# EAGLE schematic HDMI_RGB_LVDS (EAGLE 6.3)

## Sheet 1 of 6
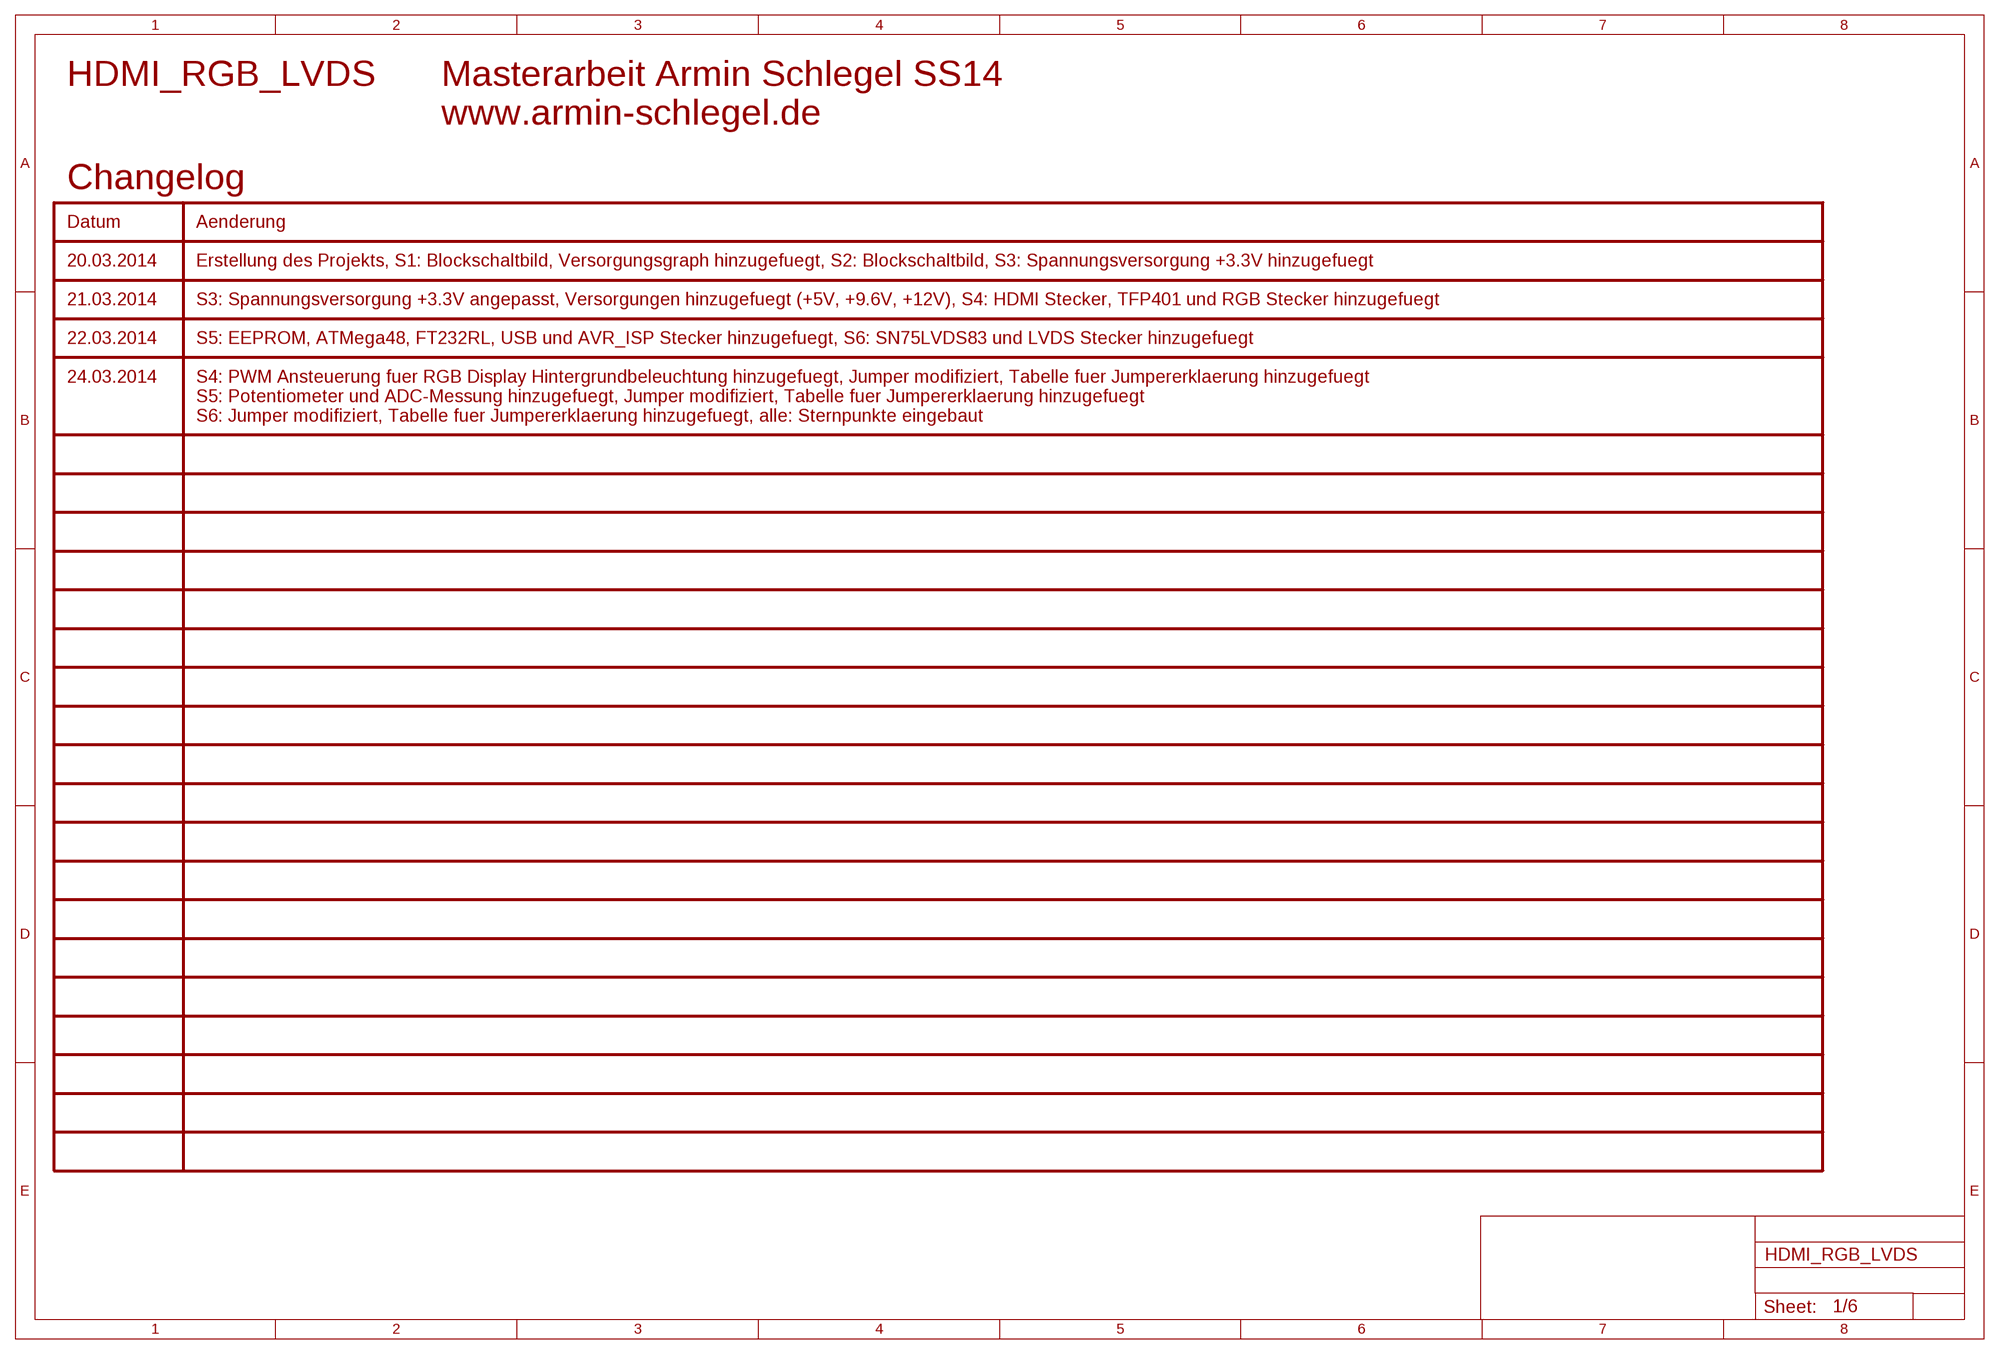
[diagram p0: schematic, sheet 1]

### Parts
U$1  FRAME_A3_LANDSCAPE  [FRAME]

### Notes on the sheet
- HDMI_RGB_LVDS | Masterarbeit Armin Schlegel SS14
- www.armin-schlegel.de
- Changelog
- Datum | Aenderung
- 20.03.2014 | Erstellung des Projekts, S1: Blockschaltbild, Versorgungsgraph hinzugefuegt, S2: Blockschaltbild, S3: Spannungsversorgung +3.3V hinzugefuegt
- 21.03.2014 | S3: Spannungsversorgung +3.3V angepasst, Versorgungen hinzugefuegt (+5V, +9.6V, +12V), S4: HDMI Stecker, TFP401 und RGB Stecker hinzugefuegt
- 22.03.2014 | S5: EEPROM, ATMega48, FT232RL, USB und AVR_ISP Stecker hinzugefuegt, S6: SN75LVDS83 und LVDS Stecker hinzugefuegt
- 24.03.2014
- S4: PWM Ansteuerung fuer RGB Display Hintergrundbeleuchtung hinzugefuegt, Jumper modifiziert, Tabelle fuer Jumpererklaerung hinzugefuegt
  S5: Potentiometer und ADC-Messung hinzugefuegt, Jumper modifiziert, Tabelle fuer Jumpererklaerung hinzugefuegt
  S6: Jumper modifiziert, Tabelle fuer Jumpererklaerung hinzugefuegt, alle: Sternpunkte eingebaut

## Sheet 2 of 6
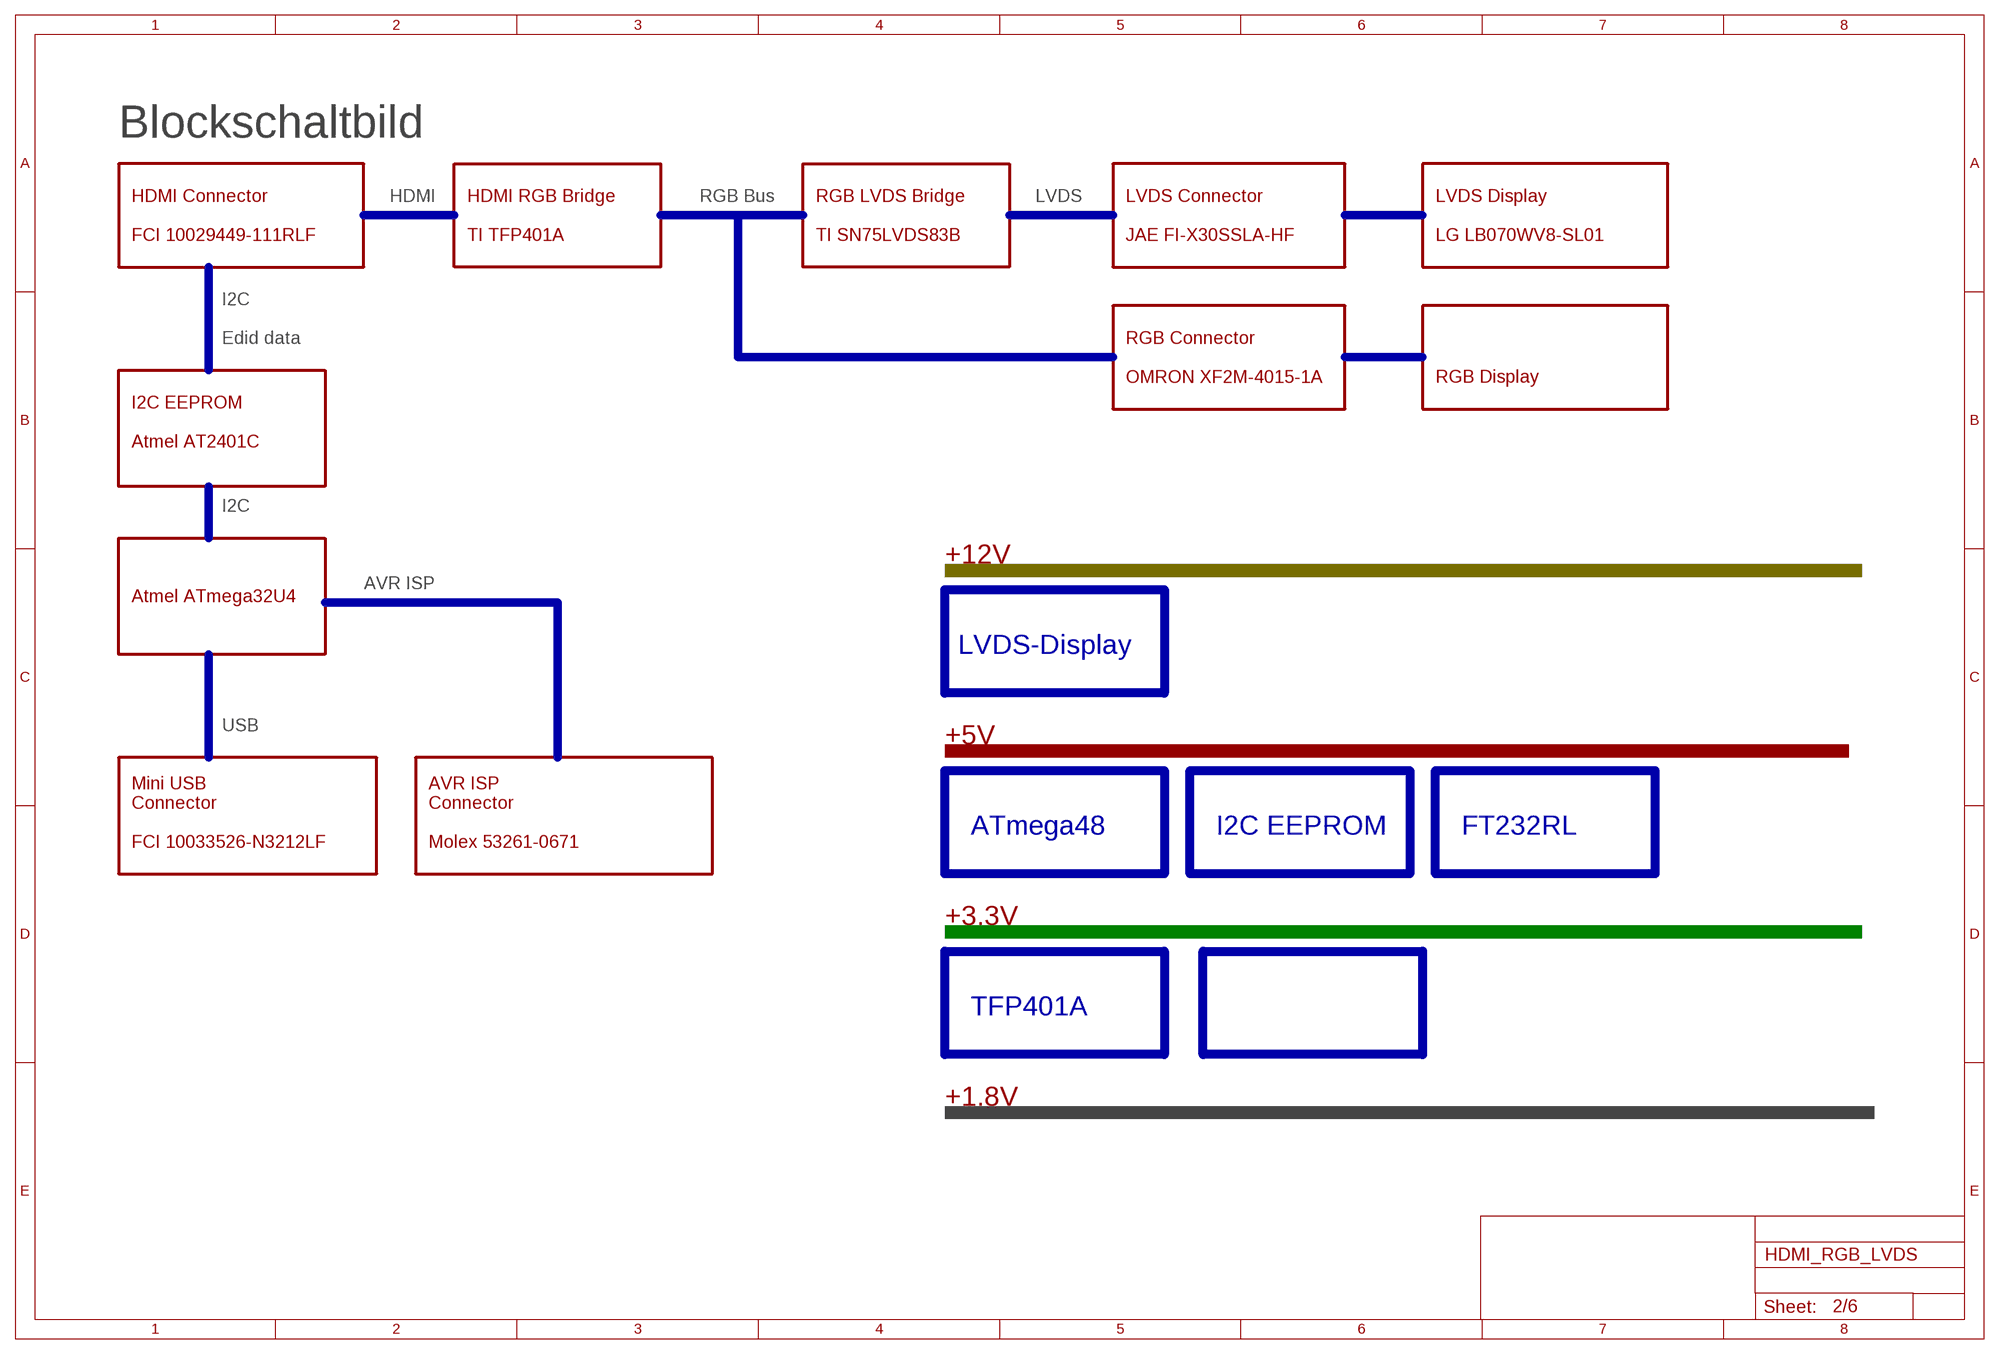
[diagram p1: schematic, sheet 2]

### Parts
U$15  FRAME_A3_LANDSCAPE  [FRAME]

### Buses
B$1
B$2
B$3
B$4
B$5
B$6
B$7
B$8
B$9
B$10
B$11
B$12

### Notes on the sheet
- Blockschaltbild
- HDMI | RGB Bus | LVDS
- HDMI Connector
  
  FCI 10029449-111RLF
- HDMI RGB Bridge
  
  TI TFP401A
- RGB LVDS Bridge
  
  TI SN75LVDS83B
- LVDS Connector
  
  JAE FI-X30SSLA-HF
- LVDS Display
  
  LG LB070WV8-SL01
- I2C
- Edid data
- RGB Connector
  
  OMRON XF2M-4015-1A
- RGB Display
- I2C EEPROM
  
  Atmel AT2401C
- I2C
- +12V
- AVR ISP
- Atmel ATmega32U4
- LVDS-Display
- USB
- +5V
- ATmega48 | I2C EEPROM | FT232RL
- Mini USB
  Connector
  
  FCI 10033526-N3212LF
- AVR ISP
  Connector
  
  Molex 53261-0671
- +3.3V
- TFP401A
- +1.8V

## Sheet 3 of 6
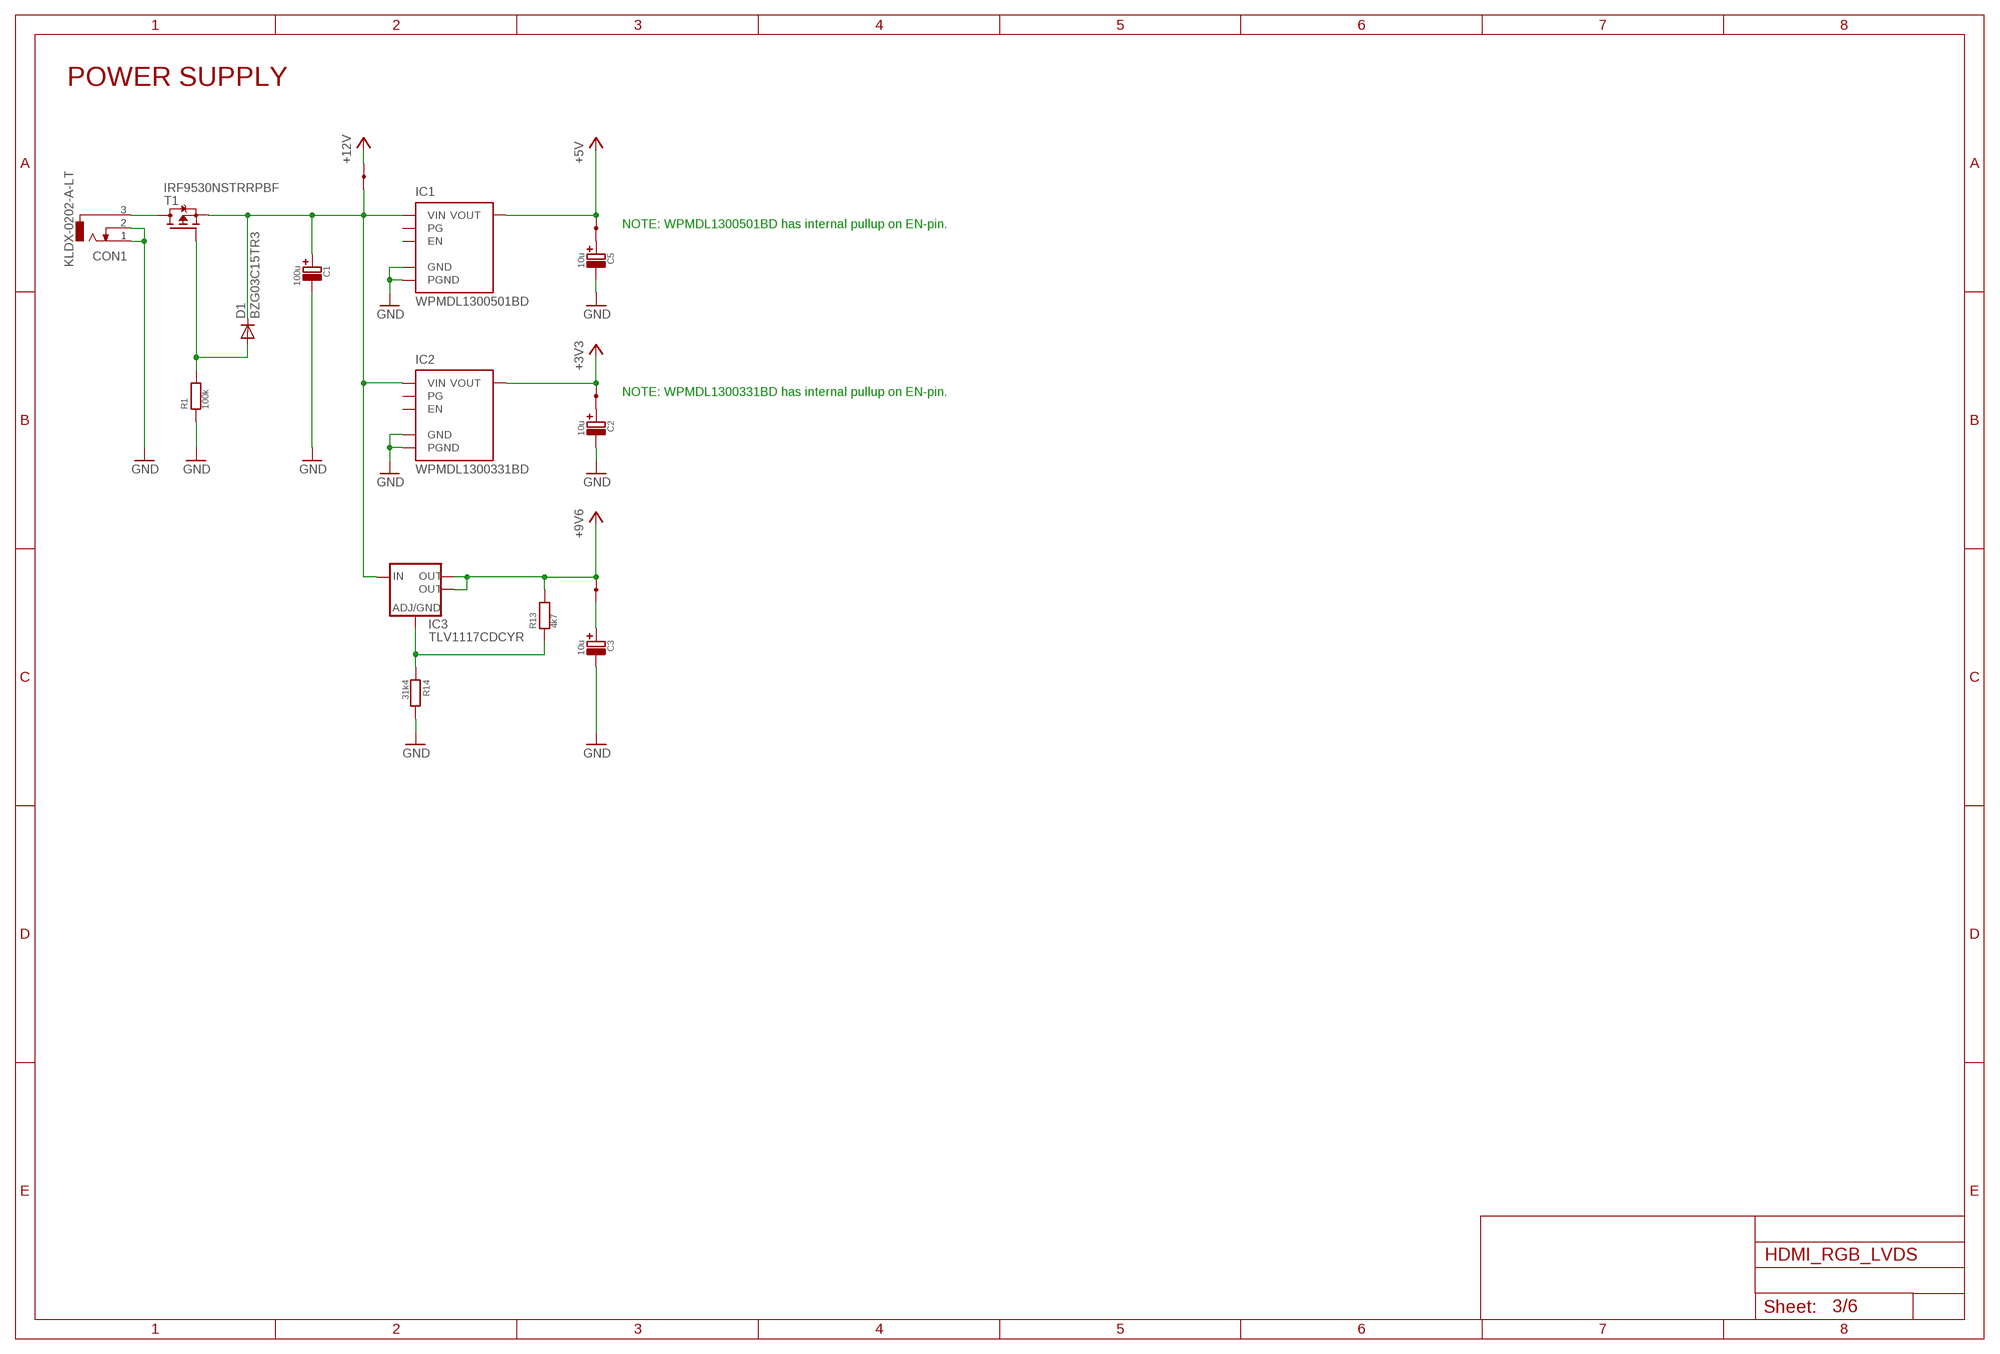
[diagram p2: schematic, sheet 3]

### Parts
C1  100u  C_POL6X6MM  [C_POL_6X6MM]
C2  10u  C_POL4X4MM  [C_POL_4X4MM]
C3  10u  C_POL4X4MM  [C_POL_4X4MM]
C5  10u  C_POL4X4MM  [C_POL_4X4MM]
CON1  KLDX-0202-A-LT  [KLDX-0202-A-LT]
D1  BZG03C15TR3  [DO214A]
IC1  WPMDL1300501BD  [TO263-5]
IC2  WPMDL1300331BD  [TO263-5]
IC3  TLV1117CDCYR  [SOT223]
R1  100k  R0402  [R0402]
R13  4k7  R0402  [R0402]
R14  31k4  R0402  [R0402]
SP1  SP2  [SP2]
T1  IRF9530NSTRRPBF  [D2PAK]
U$2  FRAME_A3_LANDSCAPE  [FRAME]
U$95  SP2  [SP2]
U$96  SP2  [SP2]
U$97  SP2  [SP2]

### Nets
+3V3: IC2.3(VOUT) U$96.P$2 ; also sheet 4,6
+5V: IC1.3(VOUT) U$95.P$2 ; also sheet 4,5
+9V6: IC3.2(OUT) IC3.4(OUT1) R13.2 U$97.P$2 ; also sheet 4
+12V: SP1.P$2 ; also sheet 6
GND: C1.- C2.- C3.- C5.- CON1.1 CON1.2 IC1.2(GND) IC1.6(PGND) IC2.2(GND) IC2.6(PGND) R1.1 R14.2 ; also sheet 4,5,6
N$2: CON1.3 T1.2(D)
N$4: D1.A R1.2 T1.1(G)
N$35: IC3.1(GND) R13.1 R14.1
N$51: C2.+ U$96.P$1
N$55: C3.+ U$97.P$1
N$56: C5.+ U$95.P$1
N$59: C1.+ D1.C IC1.1(VIN) IC2.1(VIN) IC3.3(IN) SP1.P$1 T1.3(S)
Unconnected: IC1.4(PG) IC1.5(EN) IC2.4(PG) IC2.5(EN)

### Notes on the sheet
- POWER SUPPLY
- NOTE: WPMDL1300501BD has internal pullup on EN-pin.
- NOTE: WPMDL1300331BD has internal pullup on EN-pin.

## Sheet 4 of 6
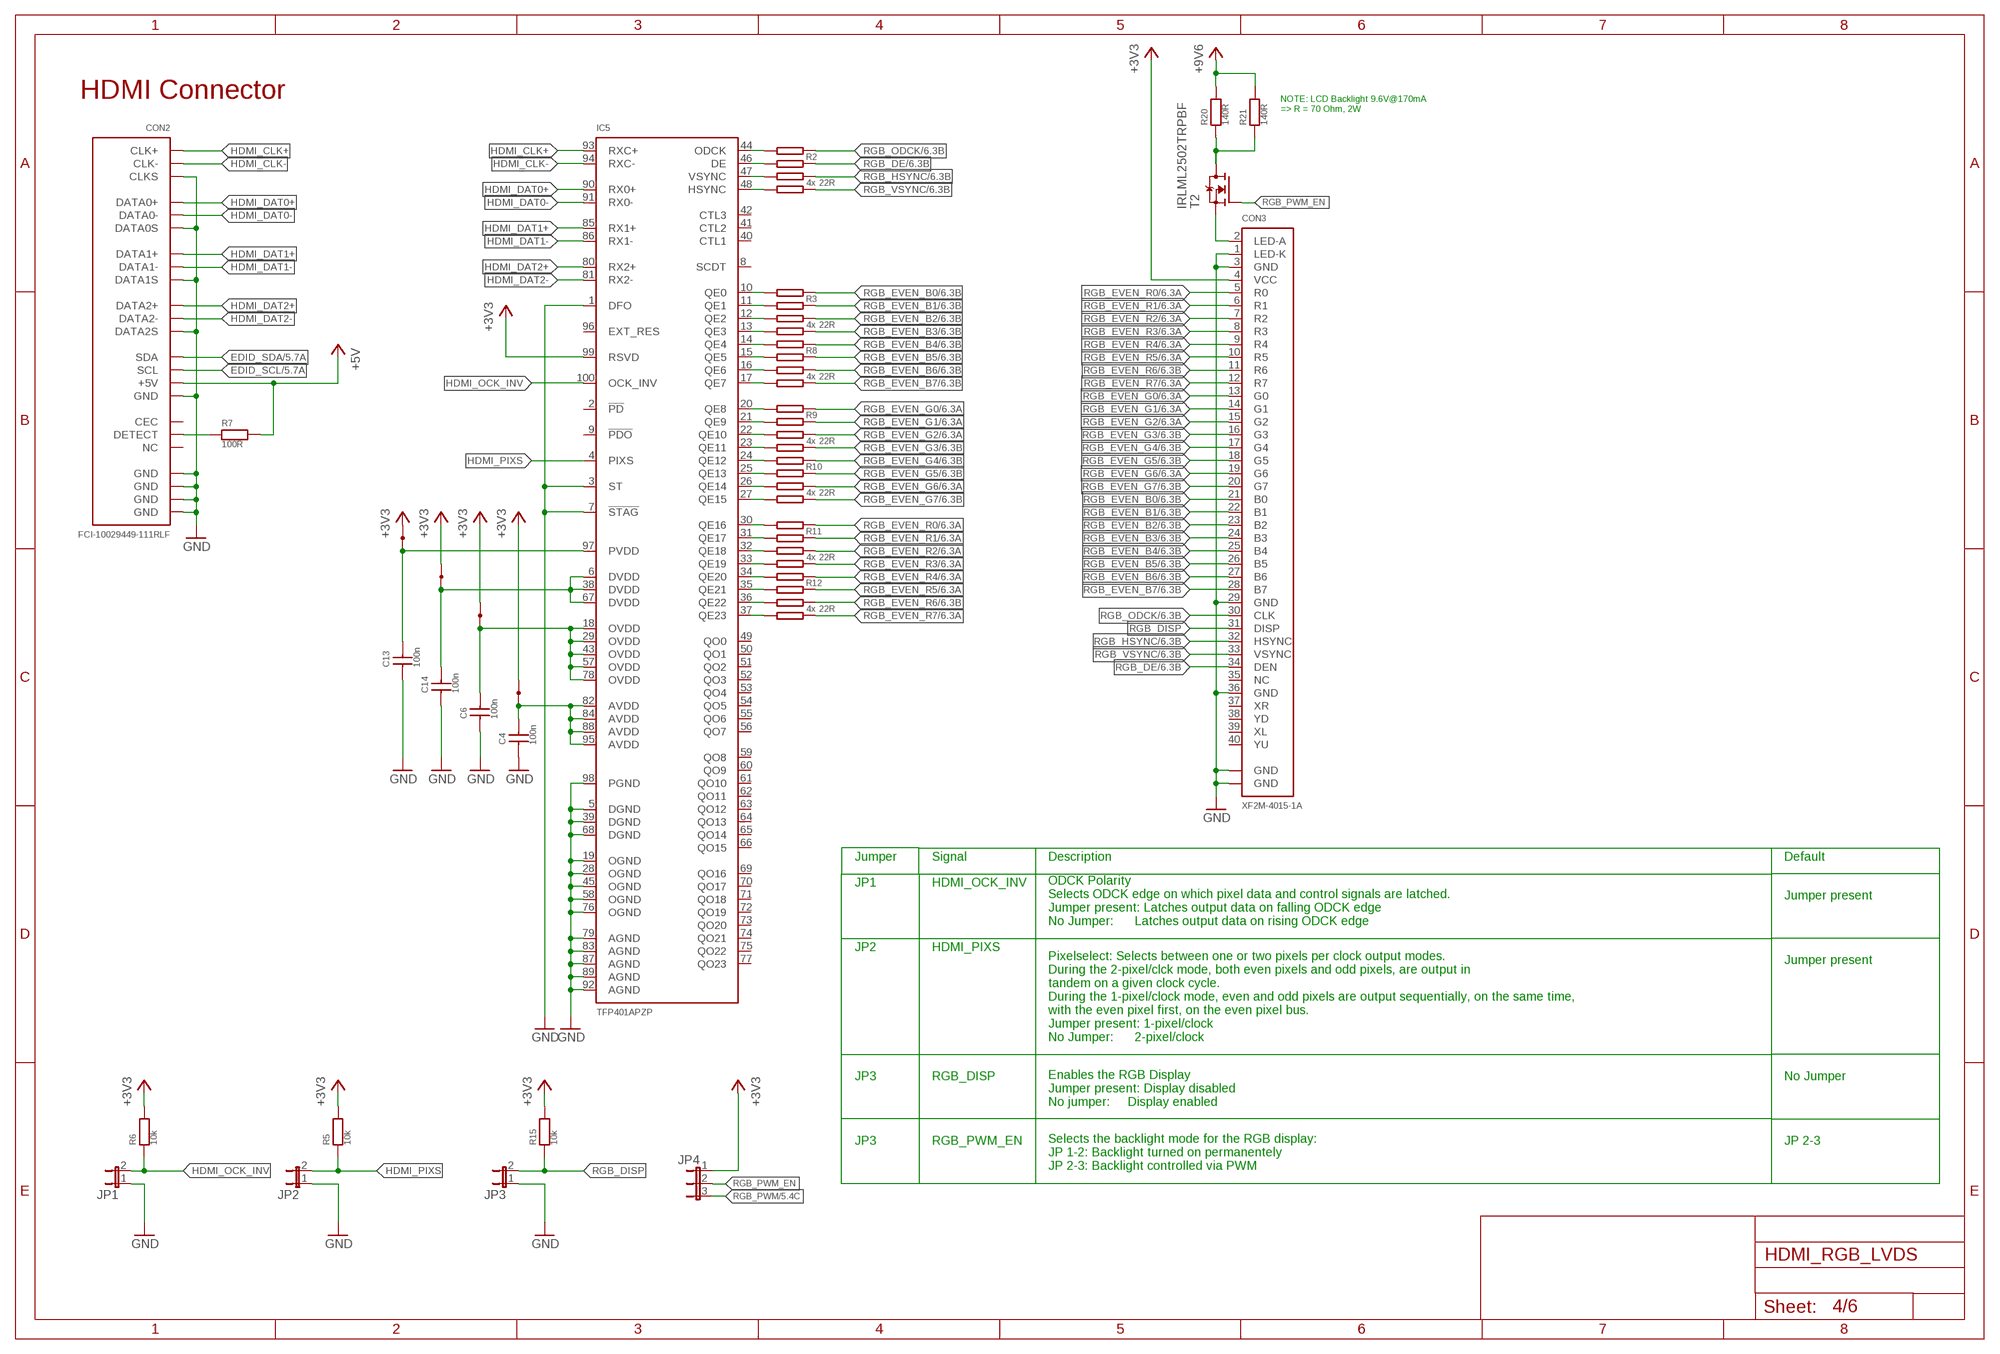
[diagram p3: schematic, sheet 4]

### Parts
C4  100n  C_SMD0402  [C0402]
C6  100n  C_SMD0402  [C0402]
C13  100n  C_SMD0402  [C0402]
C14  100n  C_SMD0402  [C0402]
CON2  FCI-10029449-111RLF  [FCI-10029449-111RLF]
CON3  XF2M-4015-1A  [XF2M-4015-1A]
IC5  TFP401APZP  [HTQFP-100]
JP1  JUMPER2  [JUMPER2_THROUGHHOLE]
JP2  JUMPER2  [JUMPER2_THROUGHHOLE]
JP3  JUMPER2  [JUMPER2_THROUGHHOLE]
JP4  JUMPER3  [JUMPER3_THROUGHHOLE]
R2  22R  CTR-742C083220JP-4X22R-4X0603  [R-ARRAY-4X0603]
R3  22R  CTR-742C083220JP-4X22R-4X0603  [R-ARRAY-4X0603]
R5  10k  R0402  [R0402]
R6  10k  R0402  [R0402]
R7  100R  R0402  [R0402]
R8  22R  CTR-742C083220JP-4X22R-4X0603  [R-ARRAY-4X0603]
R9  22R  CTR-742C083220JP-4X22R-4X0603  [R-ARRAY-4X0603]
R10  22R  CTR-742C083220JP-4X22R-4X0603  [R-ARRAY-4X0603]
R11  22R  CTR-742C083220JP-4X22R-4X0603  [R-ARRAY-4X0603]
R12  22R  CTR-742C083220JP-4X22R-4X0603  [R-ARRAY-4X0603]
R15  10k  R0402  [R0402]
R20  140R  R2512  [R2512]
R21  140R  R2512  [R2512]
SP2  SP2  [SP2]
SP3  SP2  [SP2]
SP4  SP2  [SP2]
SP5  SP2  [SP2]
T2  IRLML2502TRPBF  [SOT23]
U$3  FRAME_A3_LANDSCAPE  [FRAME]

### Nets
+3V3: CON3.4(VCC) IC5.99(RSVD) JP4.1 R5.2 R6.2 R15.2 SP2.P$2 SP3.P$2 SP4.P$2 SP5.P$2 ; also sheet 3,6
+5V: CON2.18(+5V) R7.2 ; also sheet 3,5
+9V6: R20.2 R21.2 ; also sheet 3
EDID_SCL: CON2.15(SCL) ; also sheet 5
EDID_SDA: CON2.16(SDA) ; also sheet 5
GND: C4.1 C6.1 C13.1 C14.1 CON2.2(DATA2S) CON2.5(DATA1S) CON2.8(DATA0S) CON2.11(CLKS) CON2.17(GND) CON2.GND@1(GND) CON2.GND@2(GND) CON2.GND@3(GND) CON2.GND@4(GND) CON3.1(LED-K) CON3.3(GND) CON3.29(GND) CON3.36(GND) CON3.GND@1(GND) CON3.GND@2(GND) IC5.1(DFO) IC5.3(ST) IC5.5(DGND) IC5.7(!STAG) IC5.19(OGND) IC5.28(OGND) IC5.39(DGND) IC5.45(OGND) IC5.58(OGND) IC5.68(DGND) IC5.76(OGND) IC5.79(AGND) IC5.83(AGND) IC5.87(AGND) IC5.89(AGND) IC5.92(AGND) IC5.98(PGND) JP1.1 JP2.1 JP3.1 ; also sheet 3,5,6
HDMI_CLK+: CON2.10(CLK+) IC5.93(RXC+)
HDMI_CLK-: CON2.12(CLK-) IC5.94(RXC-)
HDMI_DAT0+: CON2.7(DATA0+) IC5.90(RX0+)
HDMI_DAT0-: CON2.9(DATA0-) IC5.91(RX0-)
HDMI_DAT1+: CON2.4(DATA1+) IC5.85(RX1+)
HDMI_DAT1-: CON2.6(DATA1-) IC5.86(RX1-)
HDMI_DAT2+: CON2.1(DATA2+) IC5.80(RX2+)
HDMI_DAT2-: CON2.3(DATA2-) IC5.81(RX2-)
HDMI_OCK_INV: IC5.100(OCK_INV) JP1.2 R6.1
HDMI_PIXS: IC5.4(PIXS) JP2.2 R5.1
N$1: IC5.48(HSYNC) R2.1M
N$6: IC5.47(VSYNC) R2.2M
N$7: IC5.46(DE) R2.3M
N$8: IC5.44(ODCK) R2.4M
N$9: IC5.13(QE3) R3.1M
N$11: IC5.12(QE2) R3.2M
N$12: IC5.11(QE1) R3.3M
N$13: IC5.10(QE0) R3.4M
N$14: IC5.17(QE7) R8.1M
N$15: IC5.16(QE6) R8.2M
N$16: IC5.15(QE5) R8.3M
N$17: IC5.14(QE4) R8.4M
N$18: CON2.19(DETECT) R7.1
N$19: IC5.23(QE11) R9.1M
N$20: IC5.22(QE10) R9.2M
N$21: IC5.21(QE9) R9.3M
N$22: IC5.20(QE8) R9.4M
N$23: IC5.27(QE15) R10.1M
N$24: IC5.26(QE14) R10.2M
N$25: IC5.25(QE13) R10.3M
N$26: IC5.24(QE12) R10.4M
N$27: IC5.33(QE19) R11.1M
N$28: IC5.32(QE18) R11.2M
N$29: IC5.31(QE17) R11.3M
N$30: IC5.30(QE16) R11.4M
N$31: IC5.37(QE23) R12.1M
N$32: IC5.36(QE22) R12.2M
N$33: IC5.35(QE21) R12.3M
N$34: IC5.34(QE20) R12.4M
N$37: CON3.2(LED-A) T2.2(S)
N$50: C6.2 IC5.18(OVDD) IC5.29(OVDD) IC5.43(OVDD) IC5.57(OVDD) IC5.78(OVDD) SP4.P$1
N$52: C4.2 IC5.82(AVDD) IC5.84(AVDD) IC5.88(AVDD) IC5.95(AVDD) SP5.P$1
N$53: C13.2 IC5.97(PVDD) SP2.P$1
N$54: C14.2 IC5.6(DVDD) IC5.38(DVDD) IC5.67(DVDD) SP3.P$1
N$57: R20.1 R21.1 T2.3(D)
RGB_DE: CON3.34(DEN) R2.3P ; also sheet 6
RGB_DISP: CON3.31(DISP) JP3.2 R15.1
RGB_EVEN_B0: CON3.21(B0) R3.4P ; also sheet 6
RGB_EVEN_B1: CON3.22(B1) R3.3P ; also sheet 6
RGB_EVEN_B2: CON3.23(B2) R3.2P ; also sheet 6
RGB_EVEN_B3: CON3.24(B3) R3.1P ; also sheet 6
RGB_EVEN_B4: CON3.25(B4) R8.4P ; also sheet 6
RGB_EVEN_B5: CON3.26(B5) R8.3P ; also sheet 6
RGB_EVEN_B6: CON3.27(B6) R8.2P ; also sheet 6
RGB_EVEN_B7: CON3.28(B7) R8.1P ; also sheet 6
RGB_EVEN_G0: CON3.13(G0) R9.4P ; also sheet 6
RGB_EVEN_G1: CON3.14(G1) R9.3P ; also sheet 6
RGB_EVEN_G2: CON3.15(G2) R9.2P ; also sheet 6
RGB_EVEN_G3: CON3.16(G3) R9.1P ; also sheet 6
RGB_EVEN_G4: CON3.17(G4) R10.4P ; also sheet 6
RGB_EVEN_G5: CON3.18(G5) R10.3P ; also sheet 6
RGB_EVEN_G6: CON3.19(G6) R10.2P ; also sheet 6
RGB_EVEN_G7: CON3.20(G7) R10.1P ; also sheet 6
RGB_EVEN_R0: CON3.5(R0) R11.4P ; also sheet 6
RGB_EVEN_R1: CON3.6(R1) R11.3P ; also sheet 6
RGB_EVEN_R2: CON3.7(R2) R11.2P ; also sheet 6
RGB_EVEN_R3: CON3.8(R3) R11.1P ; also sheet 6
RGB_EVEN_R4: CON3.9(R4) R12.4P ; also sheet 6
RGB_EVEN_R5: CON3.10(R5) R12.3P ; also sheet 6
RGB_EVEN_R6: CON3.11(R6) R12.2P ; also sheet 6
RGB_EVEN_R7: CON3.12(R7) R12.1P ; also sheet 6
RGB_HSYNC: CON3.32(HSYNC) R2.2P ; also sheet 6
RGB_ODCK: CON3.30(CLK) R2.4P ; also sheet 6
RGB_PWM: JP4.3 ; also sheet 5
RGB_PWM_EN: JP4.2 T2.1(G)
RGB_VSYNC: CON3.33(VSYNC) R2.1P ; also sheet 6
Unconnected: CON2.13(CEC) CON2.14(NC) CON3.35(NC) CON3.37(XR) CON3.38(YD) CON3.39(XL) CON3.40(YU) IC5.2(!PD) IC5.8(SCDT) IC5.9(!PDO) IC5.40(CTL1) IC5.41(CTL2) IC5.42(CTL3) IC5.49(QO0) IC5.50(QO1) IC5.51(QO2) IC5.52(QO3) IC5.53(QO4) IC5.54(QO5) IC5.55(QO6) IC5.56(QO7) IC5.59(QO8) IC5.60(QO9) IC5.61(QO10) IC5.62(QO11) IC5.63(QO12) IC5.64(QO13) IC5.65(QO14) IC5.66(QO15) IC5.69(QO16) IC5.70(QO17) IC5.71(QO18) IC5.72(QO19) IC5.73(QO20) IC5.74(QO21) IC5.75(QO22) IC5.77(QO23) IC5.96(EXT_RES)

### Notes on the sheet
- HDMI Connector
- NOTE: LCD Backlight 9.6V@170mA
  => R = 70 Ohm, 2W
- Jumper | Signal | Description | Default
- JP1 | HDMI_OCK_INV
- Jumper present
- ODCK Polarity
  Selects ODCK edge on which pixel data and control signals are latched. 
  Jumper present: Latches output data on falling ODCK edge 
  No Jumper:      Latches output data on rising ODCK edge
- JP2 | HDMI_PIXS
- Jumper present
- Pixelselect: Selects between one or two pixels per clock output modes. 
  During the 2-pixel/clck mode, both even pixels and odd pixels, are output in 
  tandem on a given clock cycle.
  During the 1-pixel/clock mode, even and odd pixels are output sequentially, on the same time,
  with the even pixel first, on the even pixel bus.
  Jumper present: 1-pixel/clock
  No Jumper:      2-pixel/clock
- JP3 | RGB_DISP | No Jumper
- Enables the RGB Display
  Jumper present: Display disabled
  No jumper:     Display enabled
- JP3 | RGB_PWM_EN | JP 2-3
- Selects the backlight mode for the RGB display:
  JP 1-2: Backlight turned on permanentely
  JP 2-3: Backlight controlled via PWM

## Sheet 5 of 6
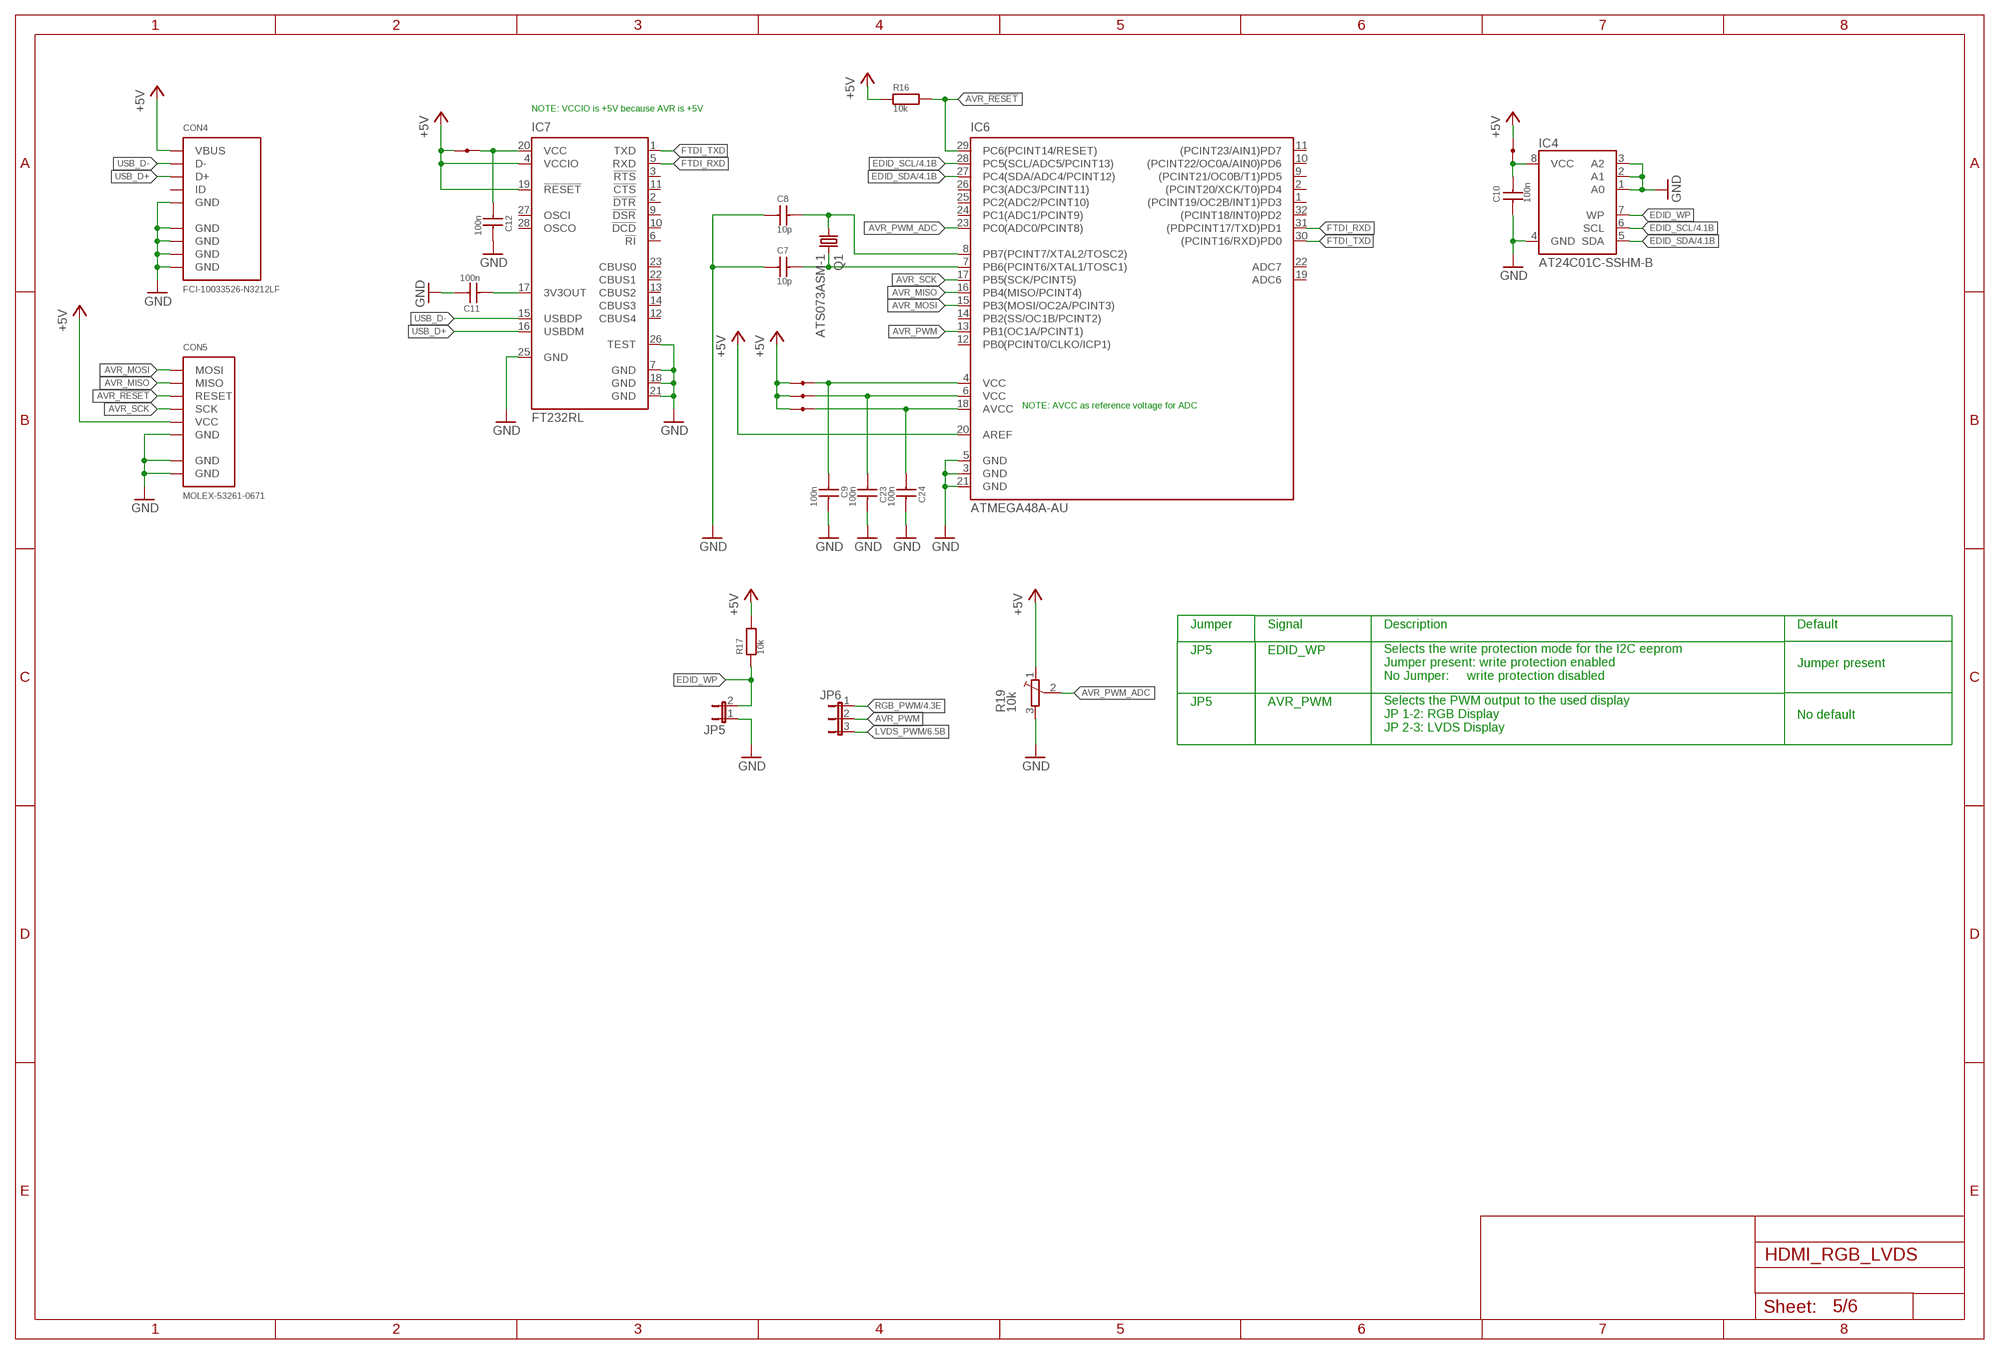
[diagram p4: schematic, sheet 5]

### Parts
C7  10p  C_SMD0402  [C0402]
C8  10p  C_SMD0402  [C0402]
C9  100n  C_SMD0402  [C0402]
C10  100n  C_SMD0402  [C0402]
C11  100n  C_SMD0402  [C0402]
C12  100n  C_SMD0402  [C0402]
C23  100n  C_SMD0402  [C0402]
C24  100n  C_SMD0402  [C0402]
CON4  FCI-10033526-N3212LF  [FCI-10033526-N3212LF]
CON5  MOLEX-53261-0671  [MOLEX-53261-0671]
IC4  AT24C01C-SSHM-B  [SOIC8]
IC6  ATMEGA48A-AU  [TQFP32]
IC7  FT232RL  [SSOP28]
JP5  JUMPER2  [JUMPER2_THROUGHHOLE]
JP6  JUMPER3  [JUMPER3_THROUGHHOLE]
Q1  ATS073ASM-1  [HC49/USSM]
R16  10k  R0402  [R0402]
R17  10k  R0402  [R0402]
R19  10k  35WR5KLFTR  [35WR5KLFTR]
SP9  SP2  [SP2]
SP10  SP2  [SP2]
SP11  SP2  [SP2]
SP12  SP2  [SP2]
SP13  SP2  [SP2]
U$4  FRAME_A3_LANDSCAPE  [FRAME]

### Nets
+5V: CON4.1(VBUS) CON5.5(VCC) IC6.20(AREF) IC7.4(VCCIO) IC7.19(!RESET) R16.1 R17.2 R19.1(E) SP9.P$2 SP10.P$1 SP11.P$1 SP12.P$1 SP13.P$1 ; also sheet 3,4
AVR_!RESET: CON5.3(RESET) IC6.29(PC6(PCINT14/RESET)) R16.2
AVR_MISO: CON5.2(MISO) IC6.16(PB4(MISO/PCINT4))
AVR_MOSI: CON5.1(MOSI) IC6.15(PB3(MOSI/OC2A/PCINT3))
AVR_PWM: IC6.13(PB1(OC1A/PCINT1)) JP6.2
AVR_PWM_ADC: IC6.23(PC0(ADC0/PCINT8)) R19.2(S)
AVR_SCK: CON5.4(SCK) IC6.17(PB5(SCK/PCINT5))
AVR_XTAL1: C7.2 IC6.7(PB6(PCINT6/XTAL1/TOSC1)) Q1.2
AVR_XTAL2: C8.2 IC6.8(PB7(PCINT7/XTAL2/TOSC2)) Q1.1
EDID_SCL: IC4.6(SCL) IC6.28(PC5(SCL/ADC5/PCINT13)) ; also sheet 4
EDID_SDA: IC4.5(SDA) IC6.27(PC4(SDA/ADC4/PCINT12)) ; also sheet 4
EDID_WP: IC4.7(WP) JP5.2 R17.1
FTDI_3V3OUT: C11.1 IC7.17(3V3OUT)
FTDI_RXD: IC6.31((PDPCINT17/TXD)PD1) IC7.5(RXD)
FTDI_TXD: IC6.30((PCINT16/RXD)PD0) IC7.1(TXD)
GND: C7.1 C8.1 C9.2 C10.1 C11.2 C12.2 C23.2 C24.2 CON4.5(GND) CON4.GND@1(GND) CON4.GND@2(GND) CON4.GND@3(GND) CON4.GND@4(GND) CON5.6(GND) CON5.GND@1(GND) CON5.GND@2(GND) IC4.1(A0) IC4.2(A1) IC4.3(A2) IC4.4(GND) IC6.3(GND) IC6.5(GND) IC6.21(GND) IC7.7(GND) IC7.18(GND) IC7.21(GND) IC7.25(GND) IC7.26(TEST) JP5.1 R19.3(A) ; also sheet 3,4,6
LVDS_PWM: JP6.3 ; also sheet 6
N$44: C12.1 IC7.20(VCC) SP9.P$1
N$45: C24.1 IC6.18(AVCC) SP13.P$2
N$46: C9.1 IC6.4(VCC) SP11.P$2
N$47: C23.1 IC6.6(VCC) SP12.P$2
N$49: C10.2 IC4.8(VCC) SP10.P$2
RGB_PWM: JP6.1 ; also sheet 4
USB_D+: CON4.3(D+) IC7.16(USBDM)
USB_D-: CON4.2(D-) IC7.15(USBDP)
Unconnected: CON4.4(ID) IC6.1((PCINT19/OC2B/INT1)PD3) IC6.2((PCINT20/XCK/T0)PD4) IC6.9((PCINT21/OC0B/T1)PD5) IC6.10((PCINT22/OC0A/AIN0)PD6) IC6.11((PCINT23/AIN1)PD7) IC6.12(PB0(PCINT0/CLKO/ICP1)) IC6.14(PB2(SS/OC1B/PCINT2)) IC6.19(ADC6) IC6.22(ADC7) IC6.24(PC1(ADC1/PCINT9)) IC6.25(PC2(ADC2/PCINT10)) IC6.26(PC3(ADC3/PCINT11)) IC6.32((PCINT18/INT0)PD2) IC7.2(!DTR) IC7.3(!RTS) IC7.6(!RI) IC7.9(!DSR) IC7.10(!DCD) IC7.11(!CTS) IC7.12(CBUS4) IC7.13(CBUS2) IC7.14(CBUS3) IC7.22(CBUS1) IC7.23(CBUS0) IC7.27(OSCI) IC7.28(OSCO)

### Notes on the sheet
- NOTE: VCCIO is +5V because AVR is +5V
- NOTE: AVCC as reference voltage for ADC
- Jumper | Signal | Description | Default
- JP5 | EDID_WP
- Jumper present
- Selects the write protection mode for the I2C eeprom
  Jumper present: write protection enabled
  No Jumper:     write protection disabled
- JP5 | AVR_PWM
- No default
- Selects the PWM output to the used display
  JP 1-2: RGB Display
  JP 2-3: LVDS Display

## Sheet 6 of 6
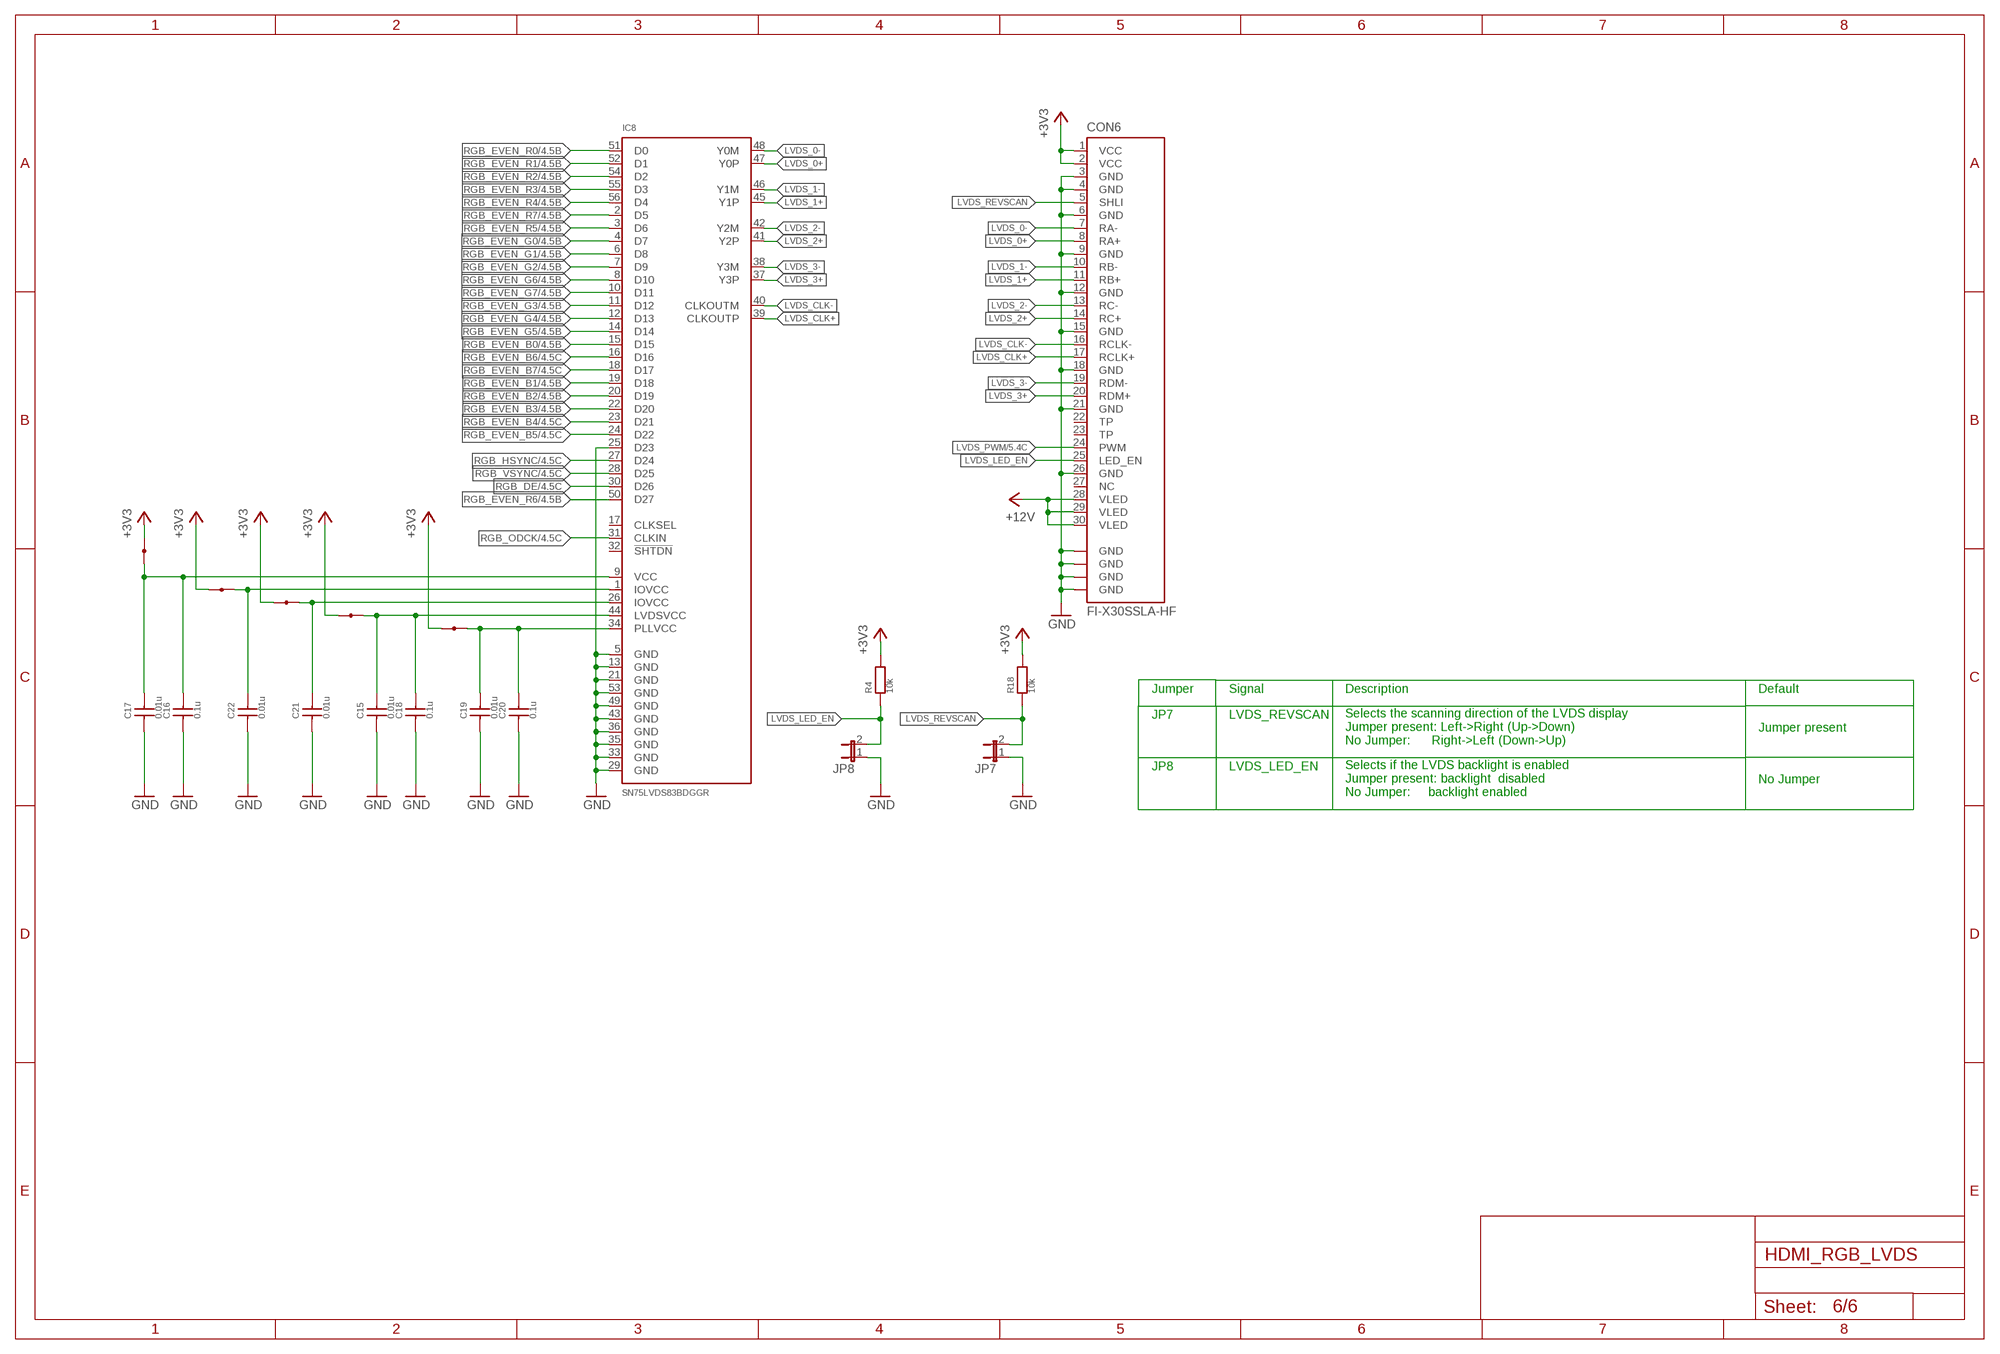
[diagram p5: schematic, sheet 6]

### Parts
C15  0.01u  C_SMD0402  [C0402]
C16  0.1u  C_SMD0402  [C0402]
C17  0.01u  C_SMD0402  [C0402]
C18  0.1u  C_SMD0402  [C0402]
C19  0.01u  C_SMD0402  [C0402]
C20  0.1u  C_SMD0402  [C0402]
C21  0.01u  C_SMD0402  [C0402]
C22  0.01u  C_SMD0402  [C0402]
CON6  FI-X30SSLA-HF  [FI-X30SSLA-HF]
IC8  SN75LVDS83BDGGR  [TSSOP-56]
JP7  JUMPER2  [JUMPER2_THROUGHHOLE]
JP8  JUMPER2  [JUMPER2_THROUGHHOLE]
R4  10k  R0402  [R0402]
R18  10k  R0402  [R0402]
SP14  SP2  [SP2]
SP15  SP2  [SP2]
SP16  SP2  [SP2]
SP17  SP2  [SP2]
SP18  SP2  [SP2]
U$5  FRAME_A3_LANDSCAPE  [FRAME]

### Nets
+3V3: CON6.1(VCC) CON6.2(VCC) R4.2 R18.2 SP14.P$2 SP15.P$2 SP16.P$2 SP17.P$2 SP18.P$2 ; also sheet 3,4
+12V: CON6.28(VLED) CON6.29(VLED) CON6.30(VLED) ; also sheet 3
GND: C15.1 C16.1 C17.1 C18.1 C19.1 C20.1 C21.1 C22.1 CON6.3(GND) CON6.4(GND) CON6.6(GND) CON6.9(GND) CON6.12(GND) CON6.15(GND) CON6.18(GND) CON6.21(GND) CON6.26(GND) CON6.GND@1(GND) CON6.GND@2(GND) CON6.GND@3(GND) CON6.GND@4(GND) IC8.5(GND) IC8.13(GND) IC8.21(GND) IC8.25(D23) IC8.29(GND) IC8.33(GND) IC8.35(GND) IC8.36(GND) IC8.43(GND) IC8.49(GND) IC8.53(GND) JP7.1 JP8.1 ; also sheet 3,4,5
LVDS_0+: CON6.8(RA+) IC8.47(Y0P)
LVDS_0-: CON6.7(RA-) IC8.48(Y0M)
LVDS_1+: CON6.11(RB+) IC8.45(Y1P)
LVDS_1-: CON6.10(RB-) IC8.46(Y1M)
LVDS_2+: CON6.14(RC+) IC8.41(Y2P)
LVDS_2-: CON6.13(RC-) IC8.42(Y2M)
LVDS_3+: CON6.20(RDM+) IC8.37(Y3P)
LVDS_3-: CON6.19(RDM-) IC8.38(Y3M)
LVDS_CLK+: CON6.17(RCLK+) IC8.39(CLKOUTP)
LVDS_CLK-: CON6.16(RCLK-) IC8.40(CLKOUTM)
LVDS_LED_EN: CON6.25(LED_EN) JP8.2 R4.1
LVDS_PWM: CON6.24(PWM) ; also sheet 5
LVDS_REVSCAN: CON6.5(SHLI) JP7.2 R18.1
N$39: C22.2 IC8.1(IOVCC) SP15.P$1
N$41: C21.2 IC8.26(IOVCC) SP16.P$1
N$42: C15.2 C18.2 IC8.44(LVDSVCC) SP17.P$1
N$43: C19.2 C20.2 IC8.34(PLLVCC) SP18.P$1
N$48: C16.2 C17.2 IC8.9(VCC) SP14.P$1
RGB_DE: IC8.30(D26) ; also sheet 4
RGB_EVEN_B0: IC8.15(D15) ; also sheet 4
RGB_EVEN_B1: IC8.19(D18) ; also sheet 4
RGB_EVEN_B2: IC8.20(D19) ; also sheet 4
RGB_EVEN_B3: IC8.22(D20) ; also sheet 4
RGB_EVEN_B4: IC8.23(D21) ; also sheet 4
RGB_EVEN_B5: IC8.24(D22) ; also sheet 4
RGB_EVEN_B6: IC8.16(D16) ; also sheet 4
RGB_EVEN_B7: IC8.18(D17) ; also sheet 4
RGB_EVEN_G0: IC8.4(D7) ; also sheet 4
RGB_EVEN_G1: IC8.6(D8) ; also sheet 4
RGB_EVEN_G2: IC8.7(D9) ; also sheet 4
RGB_EVEN_G3: IC8.11(D12) ; also sheet 4
RGB_EVEN_G4: IC8.12(D13) ; also sheet 4
RGB_EVEN_G5: IC8.14(D14) ; also sheet 4
RGB_EVEN_G6: IC8.8(D10) ; also sheet 4
RGB_EVEN_G7: IC8.10(D11) ; also sheet 4
RGB_EVEN_R0: IC8.51(D0) ; also sheet 4
RGB_EVEN_R1: IC8.52(D1) ; also sheet 4
RGB_EVEN_R2: IC8.54(D2) ; also sheet 4
RGB_EVEN_R3: IC8.55(D3) ; also sheet 4
RGB_EVEN_R4: IC8.56(D4) ; also sheet 4
RGB_EVEN_R5: IC8.3(D6) ; also sheet 4
RGB_EVEN_R6: IC8.50(D27) ; also sheet 4
RGB_EVEN_R7: IC8.2(D5) ; also sheet 4
RGB_HSYNC: IC8.27(D24) ; also sheet 4
RGB_ODCK: IC8.31(CLKIN) ; also sheet 4
RGB_VSYNC: IC8.28(D25) ; also sheet 4
Unconnected: CON6.22(TP) CON6.23(TP) CON6.27(NC) IC8.17(CLKSEL) IC8.32(!SHTDN)

### Notes on the sheet
- Jumper | Signal | Description | Default
- JP7 | LVDS_REVSCAN
- Jumper present
- Selects the scanning direction of the LVDS display
  Jumper present: Left->Right (Up->Down)
  No Jumper:      Right->Left (Down->Up)
- JP8 | LVDS_LED_EN
- No Jumper
- Selects if the LVDS backlight is enabled
  Jumper present: backlight  disabled
  No Jumper:     backlight enabled

## Library data of the parts
C1-C3 C5 = SchlegelAr_Master:C_POL: C Pol last modified: Armin Schlegel, 20.03.2014
C4 C6-C24 = SchlegelAr_Master:C_SMD: C SMD 0603, 0805, 1206 last modified: Armin Schlegel, 21.03.2014
CON1 = SchlegelAr_Master:KLDX-0202-A-LT: KLDX-0202-A-LT last modified: Armin Schlegel, 20.03.2014 http://de.mouser.com/ProductDetail/Kycon/KLDX-0202-A-LT/?qs=%2fha2pyFadug6yAePtFHF%252bYgVUqD4usJO%252bzszO19jtQE%252bUyITMB7Piw%3d%3d http://www.mouser.com/ds/2/222/KLDX_0202_LT-221016.pdf
CON2 = SchlegelAr_Master:FCI-10029449-111RLF: FCI-10029449-111RLF last modified: Armin Schlegel, 20.03.2014 http://de.mouser.com/ProductDetail/FCI/10029449-111RLF/?qs=%2Fha2pyFadug8U4IOZZI2jnut2zm2rFMAp8K8PcXPAIyrEGZ2XRAPnyrp%252b5pF2ZP7 http://portal.fciconnect.com/Comergent/en/US/adirect/fci?cmd=catProductDetail&showAddButton=true&productID=10029449111RLF
CON3 = SchlegelAr_Master:XF2M-4015-1A: Omron Electronics XF2M-4015-1A last modified: Armin Schlegel, 19.03.2014 http://de.mouser.com/ProductDetail/Molex/54132-4062/?qs=%2Fha2pyFaduiie%252bDsDPE%252bbxxE%252byCORF54wAjQh9n3aQM%3D http://www.molex.com/pdm_docs/sd/541324062_sd.pdf
CON4 = SchlegelAr_Master:FCI-10033526-N3212LF: FCI-10033526-N3212LF last modified: Armin Schlegel, 20.03.2014 http://de.mouser.com/ProductDetail/FCI/10033526-N3212LF/?qs=%2Fha2pyFadujxDEaTCG%2F3IgsbFChSuv66JrkjaCBKgukjCIH%2FH4qAI7ajoEkcwwLO http://portal.fciconnect.com/Comergent//fci/drawing/10033526.pdf
CON5 = SchlegelAr_Master:MOLEX-53261-0671: MOLEX-53261-0671 last modified: Armin Schlegel, 20.03.2014 http://de.mouser.com/ProductDetail/Molex/53261-0671/?qs=%2Fha2pyFadujL8XqTNrjzA%2Fy0AZso5hx2IWE7X8dEAdsn1tpb%2FKahAA%3D%3D http://www.mouser.com/ds/2/276/0532610671_PCB_HEADERS-170915.pdf
CON6 = SchlegelAr_Master:FI-X30SSLA-HF: JAE Electronics FI-X30SSLA-HF last modified: Armin Schlegel, 22.03.2014 http://de.mouser.com/ProductDetail/JAE-Electronics/FI-X30SSLA-HF/?qs=%2fha2pyFaduioZsvOJCeWcg109ZmKz2%2fupnzggFRdCcW4jqYF4CRRJw%3d%3d http://jae-connector.com/en/pdf_download_exec.cfm?param=SJ110033.pdf
D1 = SchlegelAr_Master:BZG03C15TR3
IC1 = SchlegelAr_Master:WPMDL1300501BD
IC2 = SchlegelAr_Master:WPMDL1300331BD
IC3 = SchlegelAr_Master:TLV1117CDCYR
IC4 = SchlegelAr_Master:AT24C01C-SSHM-B: AT24C01C-SSHM-B last modified: Armin Schlegel, 20.03.2014 http://de.mouser.com/ProductDetail/Atmel/AT24C01C-SSHM-B/?qs=%2Fha2pyFaduiPyj5Xbzu3LDkZ5LRf3e5ZoZWa68Ku1XvnUdah058QnSJuuIfSMI6G http://www.mouser.com/ds/2/36/doc8700-75503.pdf
IC5 = SchlegelAr_Master:TFP401APZP: TFP401APZP last modified: Armin Schlegel, 19.03.2014 http://de.mouser.com/ProductDetail/Texas-Instruments/TFP401APZP/?qs=sGAEpiMZZMvzx35sqAbYyS%2FHXqUWhI80Lx8TsthrfGA%3D http://www.mouser.com/ds/2/405/slds120e-285347.pdf
IC6 = SchlegelAr_Master:ATMEGA48A-AU: ATMEGA48A-AU last modified: Armin Schlegel, 22.03.2014 http://de.mouser.com/ProductDetail/Atmel/ATMEGA48A-AU/?qs=sGAEpiMZZMvqv2n3s2xjse40PngS4U1xmCDanmh3raU%3D http://www.mouser.com/ds/2/36/doc8271-50296.pdf
IC7 = SchlegelAr_Master:FT232RL: FT232RL last modified: Armin Schlegel, 19.03.2014 http://de.mouser.com/ProductDetail/FTDI/FT232RL-REEL/?qs=sGAEpiMZZMs5ceO8zL%252bTxyQLQIH6hE7q http://www.mouser.com/ds/2/163/DS_FT232R-11534.pdf
IC8 = SchlegelAr_Master:SN75LVDS83BDGGR: SN75LVDS83BDGGR last modified: Armin Schlegel, 19.03.2014 http://de.mouser.com/ProductDetail/Texas-Instruments/SN75LVDS83BDGGR/?qs=%2Fha2pyFaduhUFID9k9uYqsoOJBy0IbxuibAsBHqa1LMrXVKttVeSnesdWlE%2FojUG http://www.mouser.com/ds/2/405/slls846b-121924.pdf
JP1-JP3 JP5 JP7 JP8 = SchlegelAr_Master:JUMPER2
JP4 JP6 = SchlegelAr_Master:JUMPER3
Q1 = SchlegelAr_Master:ATS073ASM-1: ATS073ASM-1 last modified: Armin Schlegel, 21.03.2014 http://de.mouser.com/ProductDetail/CTS-Electronic-Components/ATS073ASM-1/?qs=sGAEpiMZZMsBj6bBr9Q9aSLORZG%2fS%2fcqT3YYbKWRivQ%3d http://www.mouser.com/ds/2/96/008-0309-0-32667.pdf
R1 R4-R7 R13-R18 R20 R21 = SchlegelAr_Master:R: R SMD 0603, 0805, 1206 last modified: Armin Schlegel, 21.03.2014
R2 R3 R8-R12 = SchlegelAr_Master:CTR-742C083220JP-4X22R-4X0603: CTS-742C083220JP, 4x22 Ohm, 4x0603 last modified: Armin Schlegel, 20.03.2014 http://de.mouser.com/ProductDetail/CTS/742C083220JP/?qs=%2Fha2pyFadugZw%2FZ8FzXmJjgugrSX4rX8irC%252bdOVCTeo59FWpXkhYqw%3D%3D http://pdf1.alldatasheet.net/datasheet-pdf/view/159746/CTS/741X083220JP.html
R19 = SchlegelAr_Master:35WR5KLFTR: 35WR5KLFTR last modified: Armin Schlegel, 24.03.2014 http://de.mouser.com/ProductDetail/BI-Technologies-TT-electronics/35WR5KLFTR/?qs=sGAEpiMZZMvygUB3GLcD7k0onkdf2zwbjj6v9Mqce6o%3d http://www.mouser.com/ds/2/414/35-2231.pdf
SP1-SP5 SP9-SP18 U$95-U$97 = SchlegelAr_Master:SP2: Sternpunkt SP2 last modified: Armin Schlegel, 24.03.2014
T1 = SchlegelAr_Master:IRF9530NSTRRPBF: IRF9530NSTRRPBF last modified: Armin Schlegel, 21.03.2014 http://de.mouser.com/ProductDetail/International-Rectifier/IRF9530NSTRRPBF/?qs=sGAEpiMZZMsg%252bdojMTmmLANpD1pLNZg0 http://www.mouser.com/ds/2/200/irf9530nspbf-222492.pdf
T2 = SchlegelAr_Master:IRLML2502TRPBF: IRLML2502TRPBF last modified: Armin Schlegel, 24.03.2014 http://de.mouser.com/ProductDetail/International-Rectifier/IRLML2502TRPBF/?qs=sGAEpiMZZMshyDBzk1%2fWi5%252bqVgN3%252bWS8yrGFmPL6hzw%3d http://www.mouser.com/ds/2/200/irlml2502pbf-222939.pdf
U$1-U$5 U$15 = SchlegelAr_Master:FRAME_A3_LANDSCAPE: A3 Frame querformat last modified: Armin Schlegel, 20.03.2014